# Altium schematic sheet RF.SchDoc: RF
size A4; Date: Not used; ApprovedBy: Not used; CheckedBy: Not used; Author: Not used; CompanyName: STMicroelectronics; DrawnBy: Not used; Engineer: Not used; Organization: Not used; Address1: Not used; Address2: Not used; Address3: Not used; Address4: Not used; DocumentNumber: Not used; Revision: Not used; SheetNumber: 4; SheetTotal: 6; CurrentTime: Not used; CurrentDate: Not used; Time: Not used; DocumentFullPathAndName: Not used; DocumentName: Not used; ModifiedDate: Not used; ImagePath: Not used; ProjectName: Not used; Application_BuildNumber: Not used
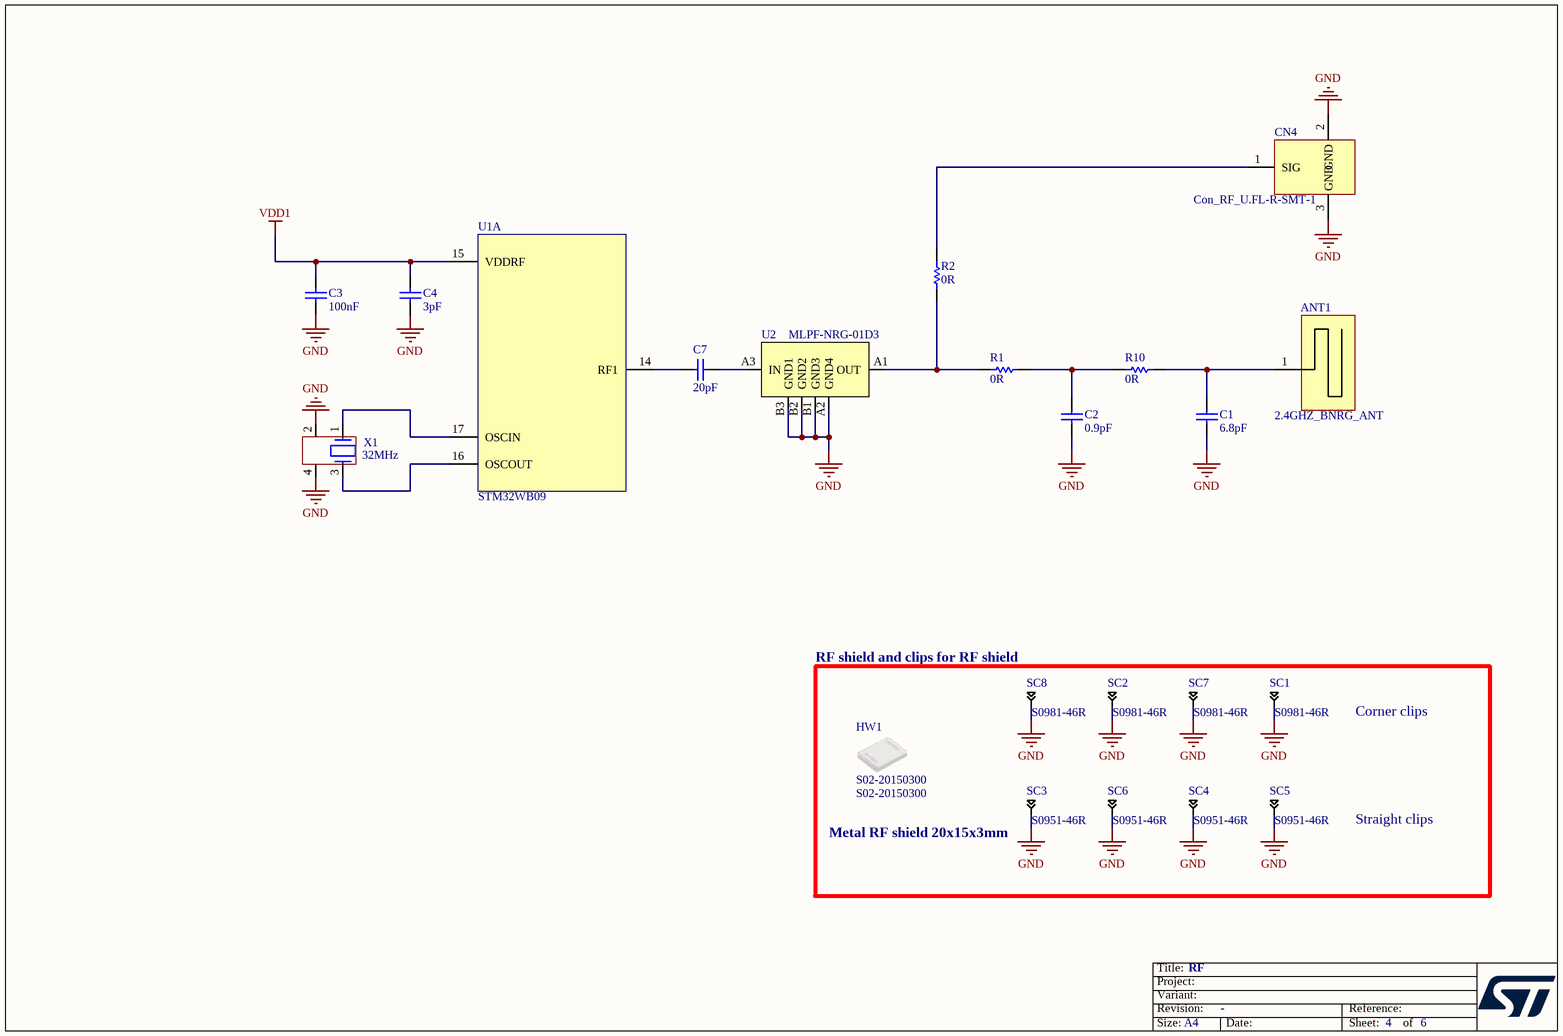
[diagram p0: RF.SchDoc]

## Parts
ANT1  value 2.4GHZ_BNRG_ANT  [ANT_BT_BNRG_2P4GHZ_MB2032]  (hidden comment: 2.4GHz_BT_ANT)  (no BOM)
C1  value 6.8pF  [C0402]  (hidden comment: Capacitor)
C2  value 0.9pF  [C0402_MURATA_GJM155_H0P5]  (hidden comment: Capacitor)
C3  value 100nF  [C0402]  (hidden comment: Capacitor)
C4  value 3pF  [C0402]  (hidden comment: Capacitor)
C7  value 20pF  [C0201_H0P3]  (hidden comment: Capacitor)
CN4  value Con_RF_U.FL-R-SMT-1  [CON_HRS_U.FL-R-SMT-1]  (hidden comment: U.FL-R-SMT-1)
HW1  S02-20150300  [SHIELD_HARWIN_S02-20150300_15X20_H3]
R1  value 0R  [R0402]  (hidden comment: Resistor)
R2  value 0R  [r0402]  (hidden comment: Resistor)
R10  value 0R  [R0402]  (hidden comment: Resistor)
SC1  value S0981-46R  [CLIP_HARWIN_S0981-46R]  (hidden comment: Shield-clip_S0951-46R)
SC2  value S0981-46R  [CLIP_HARWIN_S0981-46R]  (hidden comment: Shield-clip_S0951-46R)
SC3  value S0951-46R  [CLIP_HARWIN_S0951-46R]  (hidden comment: Shield-clip_S0951-46R)
SC4  value S0951-46R  [CLIP_HARWIN_S0951-46R]  (hidden comment: Shield-clip_S0951-46R)
SC5  value S0951-46R  [CLIP_HARWIN_S0951-46R]  (hidden comment: Shield-clip_S0951-46R)
SC6  value S0951-46R  [CLIP_HARWIN_S0951-46R]  (hidden comment: Shield-clip_S0951-46R)
SC7  value S0981-46R  [CLIP_HARWIN_S0981-46R]  (hidden comment: Shield-clip_S0951-46R)
SC8  value S0981-46R  [CLIP_HARWIN_S0981-46R]  (hidden comment: Shield-clip_S0951-46R)
U1  STM32WB09  [ICC_QFN32-EPAD_5X5_P050]  (part A of 5)
U2  value MLPF-NRG-01D3  [ICC_CSPG_6BUMPS_1X1P60_P050-P0577]  (hidden comment: MLPF-WB55-01E3)
X1  value 32MHz  [CRY_NX2016SA_4P]  (hidden comment: XTAL_4_PINS)

## Nets
GND: C1.1 C2.1 C3.1 C4.1 CN4.2(GND) CN4.3(GND) SC1.1 SC2.1 SC3.1 SC4.1 SC5.1 SC6.1 SC7.1 SC8.1 U2.A2(GND4) U2.B1(GND3) U2.B2(GND2) U2.B3(GND1) X1.2 X1.4
VDD1: C3.2 C4.2 U1.15(VDDRF)
NetANT1_1: ANT1.1 C1.2 R10.2
NetC2_2: C2.2 R1.2 R10.1
NetC7_1: C7.1 U1.14(RF1)
NetC7_2: C7.2 U2.A3(IN)
NetCN4_1: CN4.1(SIG) R2.2
NetR1_1: R1.1 R2.1 U2.A1(OUT)
NetU1_16: U1.16(OSCOUT) X1.3
NetU1_17: U1.17(OSCIN) X1.1

## Notes on the sheet
- (near SC8) RF shield and clips for RF shield
- Corner clips
- (near SC3) Metal RF shield 20x15x3mm
- Straight clips
- Title:
- Project:
- Size:
- Revision:
- Variant:
- A4
- -
- Date:
- Reference:
- Sheet:
- of

## Library data of the parts
ANT1 = MCD-03495: 2.4 GHZ Bluetooth BNRG PCB antenna; Part_Type: Misc; Part_Preference: Recommended; ShowFields: YES; ID: 5611; Component_Country_Of_Origin: Unknown; Internal_Part_Number: MCD-03495; Status: Checked; Manufacturer: N/A; Manufacturer_Part_Number: N/A; ComponentLink1URL: http://tunmcdsvn.tun.st.com/Component_Documentation_Library/Trunk; Order_Code_Digikey: N/A; Order_Code_Farnell: N/A; Order_Code_RS: N/A
C1 = MCD-03452: Capacitor, MLCC, 6.8pF, 50V, C0G, +/-0.05pF, 0402, T=0.5mm; Part_Preference: Recommended; Manufacturer: MURATA; Manufacturer_Part_Number: GJM1555C1H6R8WB01; Order_Code_RS: 3243259RL; ShowFields: YES; ID: 5568; Component_Country_Of_Origin: Japan, Singapore; Internal_Part_Number: MCD-03452; Status: Checked; Part_Type: Capacitor; Package: 0402; ComponentLink1URL: http://tunmcdsvn.tun.st.com/Component_Documentation_Library/Trunk/Capacitor/MURATA_GJM_Series/GJM1555C1H6R8WB01; Order_Code_Digikey: 490-14447-2-ND; Order_Code_Farnell: 3243259RL
C2 = MCD-04106: Capacitor, MLCC, 0.9pF, 50V, COG, +/-0.05pF, 0402, T=0.5mm; Part_Preference: Recommended; Manufacturer: MURATA; Manufacturer_Part_Number: GJM1555C1HR90WB01; Order_Code_RS: 185-3185; ShowFields: YES; ID: 6222; Internal_Part_Number: MCD-04106; Status: Checked; Part_Type: Capacitor; Package: 0402; ComponentLink1URL: http://tunmcdsvn.tun.st.com/Component_Documentation_Library/Trunk/Capacitor/MURATA_GJM_Series/GJM1555C1HR90WB01D; Order_Code_Digikey: 490-11254-2-ND; Order_Code_Farnell: 3243276
C3 = MCD-03442: Capacitor, MLCC, 100nF, ±10%, X7R, 25V, 0402, T=0.5mm; Part_Preference: Recommended; Manufacturer: MURATA; Manufacturer_Part_Number: GRM155R71E104KE14D; Order_Code_RS: NA; ShowFields: YES; ID: 5558; Component_Country_Of_Origin: China, Japan, Philippines, Singapore; Internal_Part_Number: MCD-03442; Status: Checked; Part_Type: Capacitor; Package: 0402; ComponentLink1URL: http://tunmcdsvn.tun.st.com/Component_Documentation_Library/Trunk/Capacitor/MURATA_GRM_Series/GRM155R71E104KE14; Order_Code_Digikey: 490-10698-2-ND; Order_Code_Farnell: NA
C4 = MCD-03898: Capacitor, C0G, 3 pF, 50V, NPO, ±0.1pF, 0402, T=0.5mm; Part_Preference: Recommended; Manufacturer: WALSIN TECHNOLOGY CORPORATION; Manufacturer_Part_Number: 0402N3R0B500CT; Order_Code_RS: NA; ShowFields: YES; ID: 6014; Internal_Part_Number: MCD-03898; Status: New; Part_Type: Capacitor; Package: 0402; ComponentLink1URL: http://tunmcdsvn.tun.st.com/Component_Documentation_Library/Trunk/Capacitor/WALSIN_Monolithic_Series/0402N3R0B500CT; Order_Code_Digikey: 1292-1315-2-ND; Order_Code_Farnell: NA
C7 = MCD-03543: Capacitor, MLCC, 20pF, 25V, COG, +/-2%, 0201, T=0.33mm; Part_Preference: Recommended; Manufacturer: MURATA; Manufacturer_Part_Number: GJM0335C1E200GB01; ShowFields: YES; ID: 5659; Component_Country_Of_Origin: Japan, Singapore; Internal_Part_Number: MCD-03543; Status: Checked; Part_Type: Capacitor; ComponentLink1URL: http://tunmcdsvn.tun.st.com/Component_Documentation_Library/Trunk/Capacitor/MURATA_GJM_Series; Order_Code_Digikey: 490-GJM0335C1E200GB01DTR-ND; Order_Code_Farnell: 2994012; Order_Code_RS: N/A; Package: 0201
CN4 = MCD-01583: Connector_RF, 0Hz to 6GHz, 50R, VR, SMD, T= 1.25mm; BMS_Part_Number: 9187005; Part_Preference: Recommended; Manufacturer: HIROSE; Order_Code_RS: 557-981; Component_Country_Of_Origin: Japan, Malaysia; ShowFields: YES; ID: 3683; Internal_Part_Number: MCD-01583; Status: Released; Part_Type: Connector; Manufacturer_Part_Number: U.FL-R-SMT-1; ComponentLink1URL: http://tunmcdsvn.tun.st.com/Component_Documentation_Library/Trunk/Connector/HIROSE_U.FL_Series/; Order_Code_Digikey: N/A; Order_Code_Farnell: 1688077
HW1 = MCD-03126: RFI shield can, 20x15x3mm; Part_Type: Misc; Part_Preference: Recommended; Manufacturer: HARWIN; Order_Code_RS: 161-3687; Component_Country_Of_Origin: UK°; ShowFields: YES; ID: 5242; ComponentLink1URL: http://tunmcdsvn.tun.st.com/Component_Documentation_Library/Trunk/Misc/HARWIN_S02-20150300; Internal_Part_Number: MCD-03126; Value: S02-20150300; Status: Checked; Manufacturer_Part_Number: S02-20150300; Package: 20x15x3mm; Order_Code_Digikey: 952-2632-ND; Order_Code_Farnell: 3755471
R1 R2 R10 = MCD-00052: Resistor, 0R, 0402, +/-5%, 1/16W; Part_Preference: Recommended; Manufacturer: YAGEO; Manufacturer_Part_Number: RC0402JR-070RL; Order_Code_RS: 9232516RL; Component_Country_Of_Origin: China; ShowFields: YES; ID: 2540; Internal_Part_Number: MCD-00052; Status: Released; Part_Type: Resistor; Package: 0402; ComponentLink1URL: http://tunmcdsvn.tun.st.com/Component_Documentation_Library/Trunk/Resistor/YAGEO_RC_L_Series; Order_Code_Digikey: 311-0.0JRCT-ND; Order_Code_Farnell: 9232516RL
SC1 SC2 SC7 SC8 = MCD-02164: shield clip Harwin S0981-46R to fix RF shielded cavity - SMT RFI Shield Clip, Corner (T+R); Part_Type: Mechanical; Part_Preference: Recommended; Order_Code_RS: 161-3702; Component_Country_Of_Origin: South Korea; ShowFields: YES; ID: 4264; Internal_Part_Number: MCD-02164; Status: Released; Manufacturer: HARWIN; Manufacturer_Part_Number: S0981-46R; ComponentLink1URL: http://tunmcdsvn.tun.st.com/Component_Documentation_Library/Trunk/Misc/HARWIN_S0981-46R; Order_Code_Digikey: 952-2518-1-ND; Order_Code_Farnell: 2361678; Package: 0.8x4.7x1.4mm
SC3-SC6 = MCD-01587: shield clip Harwin S0951-46R to fix RF shielded cavity; Part_Type: Mechanical; Part_Preference: Recommended; Component_Country_Of_Origin: South Korea; ShowFields: YES; ID: 3687; Internal_Part_Number: MCD-01587; Status: Released; Manufacturer: HARWIN; Manufacturer_Part_Number: S0951-46R; ComponentLink1URL: http://tunmcdsvn.tun.st.com/Component_Documentation_Library/Trunk/Misc/HARWIN_S0951-46R; Order_Code_Digikey: 952-2669-1-ND; Order_Code_Farnell: 2490970; Order_Code_RS: N/A; Package: 1.1x3.9mm
U1 = MCD-03444: Bluetooth® Low Energy wireless SoC; Part_Type: IC; Part_Preference: Recommended; Manufacturer: STMICROELECTRONICS; Component_Country_Of_Origin: Unknown; ShowFields: YES; ID: 5560; Internal_Part_Number: MCD-03444; Value: STM32WB09; Status: Checked; Manufacturer_Part_Number: STM32WB09; Package: QFN32; ComponentLink1URL: http://tunmcdsvn.tun.st.com/Component_Documentation_Library/Trunk/IC/STMICROELECTRONICS_BLUENRG-372AC; Order_Code_Digikey: N/A; Order_Code_Farnell: N/A; Order_Code_RS: N/A
U2 = MCD-03490: 2.4 GHz low pass filter matched to BLUENRG-LP-LPS; Part_Type: IC; Part_Preference: Recommended; Manufacturer: STMICROELECTRONICS; ShowFields: YES; ID: 5606; Component_Country_Of_Origin: China; Internal_Part_Number: MCD-03490; Status: Checked; Manufacturer_Part_Number: MLPF-NRG-01D3; Package: CSP; ComponentLink1URL: http://tunmcdsvn.tun.st.com/Component_Documentation_Library/Trunk/IC/STMICROELECTRONICS_MLPF-NRG-01D3; Order_Code_Digikey: 497-MLPF-NRG-01D3TR-ND; Order_Code_Farnell: N/A; Order_Code_RS: N/A
X1 = MCD-01446: Crystal, 32MHz, 8pF, +/-10ppm, 60R, 2x1.6mm; BMS_Part_Number: 9157042; Part_Type: Crystal_Osc; Part_Preference: Recommended; Manufacturer: NDK; Manufacturer_Part_Number: NX2016SA-32MHZ-EXS00A-CS06654; Component_Country_Of_Origin: Unknown; ShowFields: YES; ID: 3546; Internal_Part_Number: MCD-01446; Status: Checked; Package: 2x1.6mm; ComponentLink1URL: http://tunmcdsvn.tun.st.com/Component_Documentation_Library/Trunk/Crytal_Oscillator/NDK_NX2016SA_Series; Order_Code_Digikey: 644-1373; Order_Code_Farnell: N/A; Order_Code_RS: N/A